# EAGLE design 5volt_v0.1 (EAGLE 9.3.2)
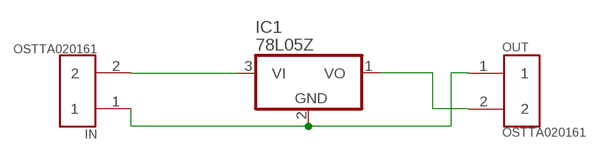
[diagram p0: schematic, sheet 1]

## Parts
IC1  78L05Z  [TO92]
IN  OSTTA020161  [OST_OSTTA020161]
OUT  OSTTA020161  [OST_OSTTA020161]

## Nets
N$1: IC1.3(VI) IN.2
N$2: IC1.1(VO) OUT.2
N$3: IC1.2(GND) IN.1 OUT.1

## Library data of the parts
IC1 = linear3:78*: Positive VOLTAGE REGULATOR Source: http://cache.national.com/ds/LM/LM78L05.pdf http://www.fairchildsemi.com/ds/LM/LM7805.pdf
IN OUT = OSTTA020161:OSTTA020161: Connector Terminal Blocks 2 Position 5mm Solder Straight Thru-Hole 16A; AVAILABILITY: Unavailable; DESCRIPTION: Connector Terminal Blocks 2 Position 5mm Solder Straight Thru-Hole 16A; MF: On Shore; MP: OSTTA020161; PACKAGE: None; PRICE: None

## Net classes
0 default: width 1.27 mm

## Board
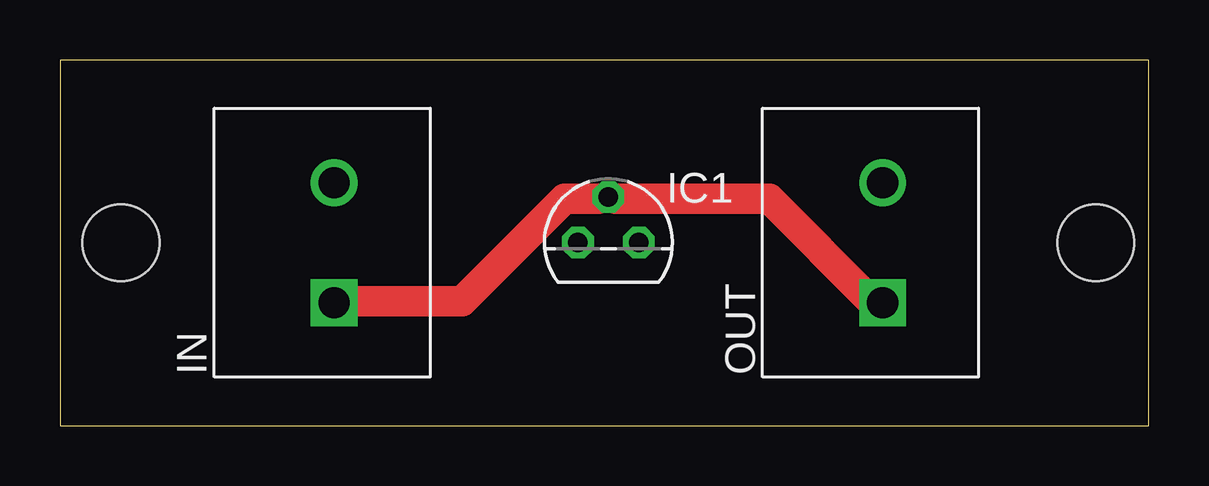
[diagram p1: board, top side]
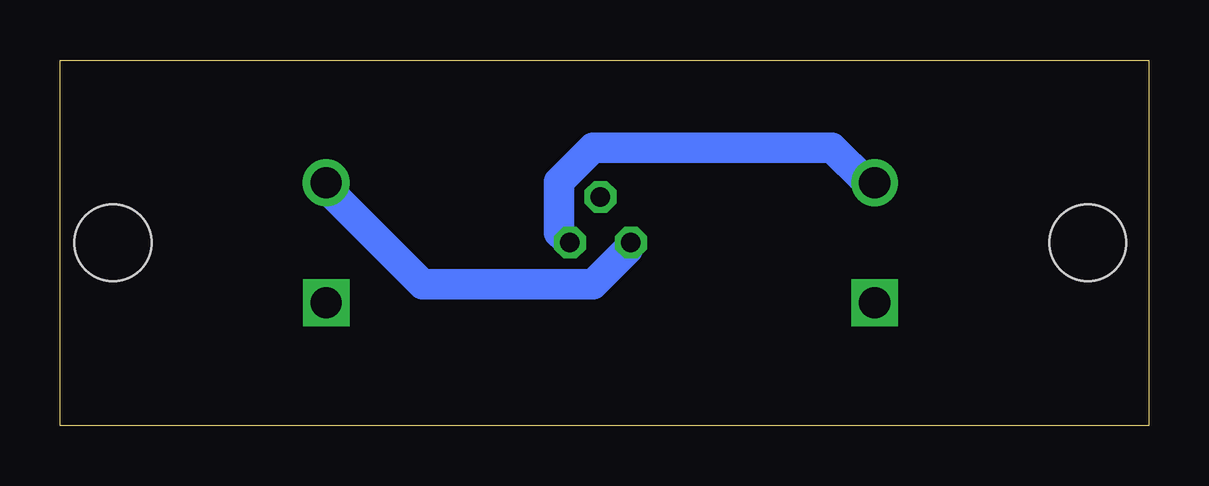
[diagram p2: board, bottom side, seen from below]

Size 45.39 x 15.23 mm. Coordinates in mm from the lower left corner, seen from the top.
Outline: 0,0 45.39,0 45.39,15.23 0,15.23 0,0
Copper layers (1*16): Top 0.035mm / dielectric 1.5mm / Bottom 0.035mm
Design rules "default": minimum track width 6mil, minimum drill 0.35mm, track to track 6mil, track to pad 6mil, pad to pad 6mil, via to via 6mil, smd to smd 6mil, copper to edge 40mil, drill to drill 6mil, minimum pad ring 10mil, minimum via ring 8mil, stop-mask expansion 4mil, vias tented up to drill 0mil, thermal gap 10mil
Holes 3.2 mm at 2.54,7.62 43.18,7.62

### Footprints (pad centres in the part's own frame; a part is rotated, then mirrored left to right if it is on the bottom)
TO92 = drill 0.813 octagon: 1 -1.27,0; 2 0,1.905; 3 1.27,0
OST_OSTTA020161 = drill 1.3 square: 1 -2.5,0 | drill 1.3: 2 2.5,0

### Placement (x,y rotation side)
IC1  22.86,7.62 0 top
IN  11.43,7.62 90 top
OUT  34.29,7.62 90 top

### Tracks (layer width: path | path; a pad name or v marks a point on that pad's centre or on a via)
N$1
  Bottom 1.27: IC1.3 24.59,8.03 24.59,10.16 23.16,11.58 13.21,11.58 11.79,10.16 IN.2
N$2
  Bottom 1.27: IC1.1 21.74,7.31 23.16,5.89 30.28,5.89 33.83,9.45 OUT.2
N$3
  Top 1.27: OUT.1 33.83,5.18 29.57,9.45 23.16,9.45 IC1.2 22.45,9.45 21.03,9.45 16.76,5.18 11.79,5.18 IN.1